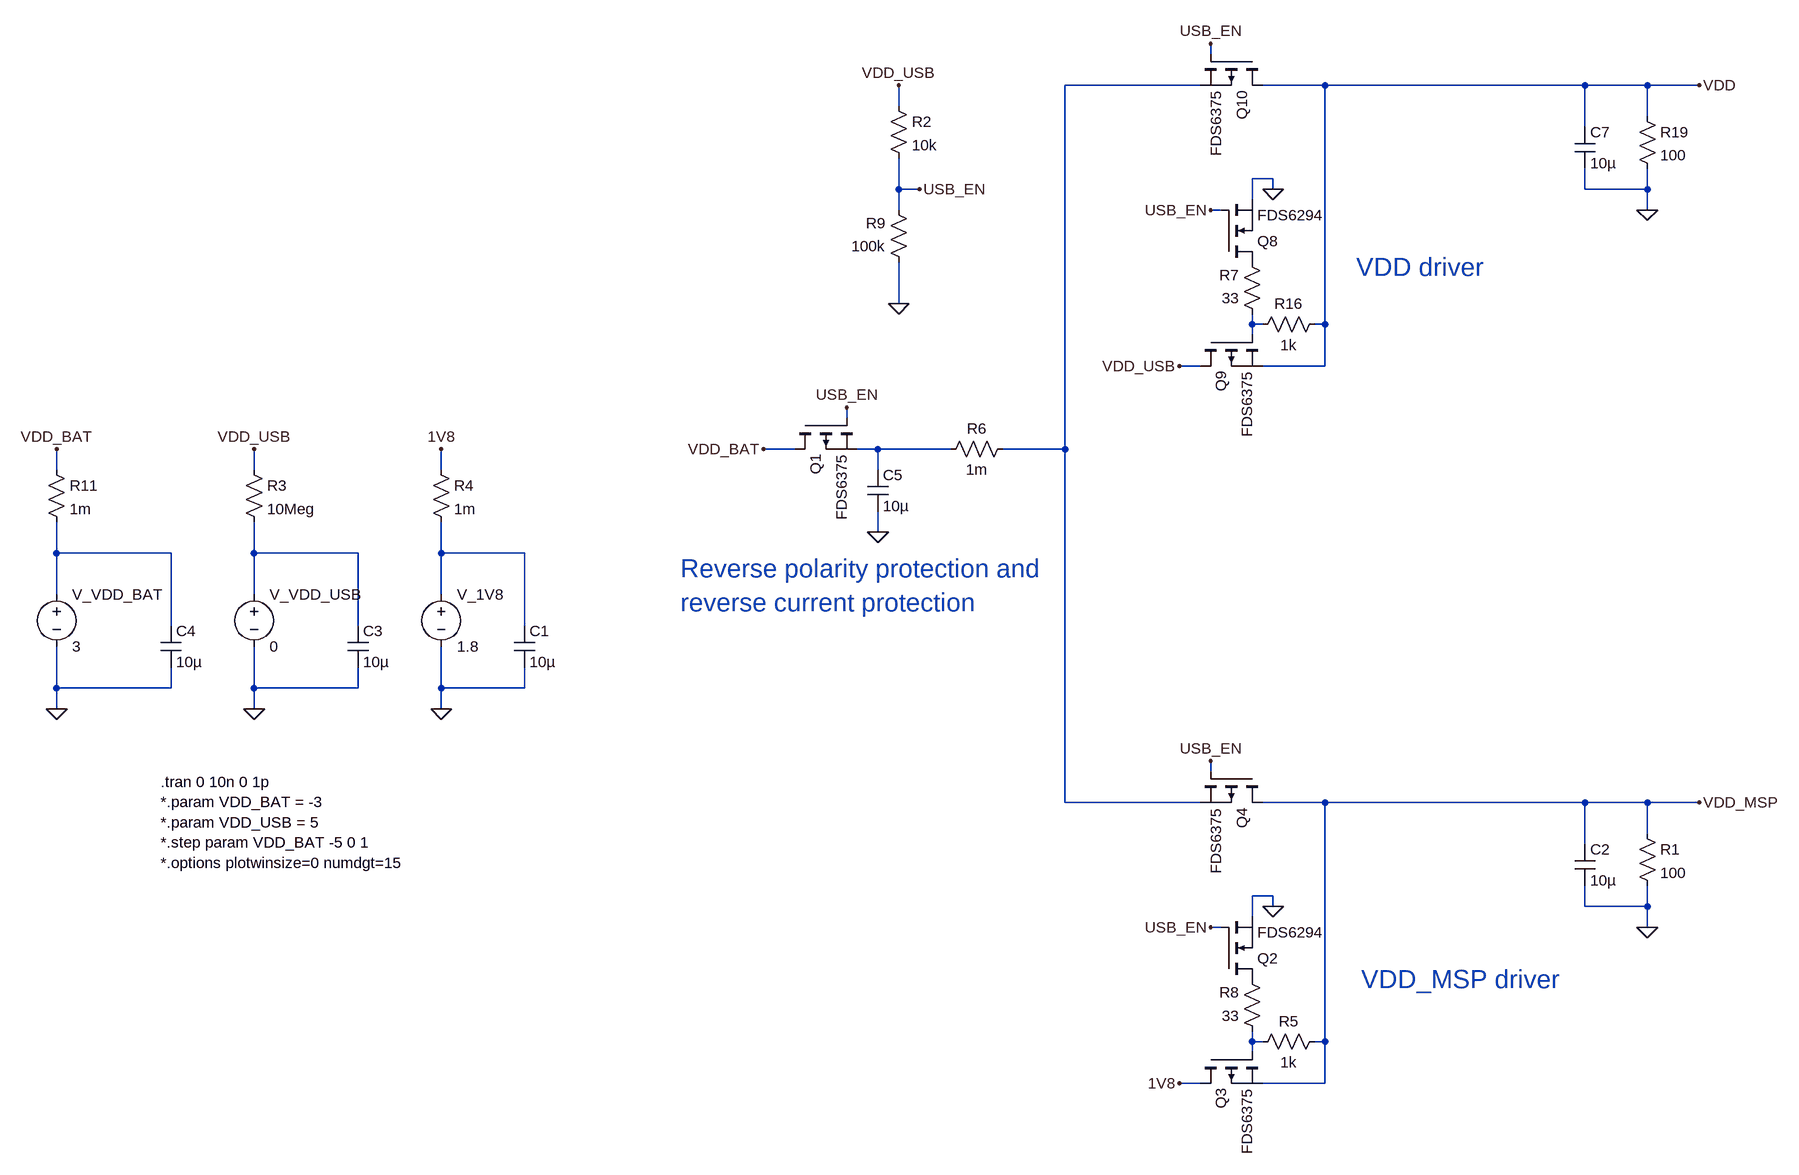
[diagram p0: schematic Schematic.asc]
Schematic.asc, the LTspice schematic file:
Version 4
SHEET 1 1688 680
WIRE -384 -1200 -384 -1216
WIRE -400 -1152 -608 -1152
WIRE -208 -1152 -304 -1152
WIRE 192 -1152 -208 -1152
WIRE 288 -1152 192 -1152
WIRE 368 -1152 288 -1152
WIRE -864 -1120 -864 -1152
WIRE 288 -1104 288 -1152
WIRE 192 -1088 192 -1152
WIRE -288 -1008 -320 -1008
WIRE -864 -992 -864 -1040
WIRE -832 -992 -864 -992
WIRE -288 -992 -288 -1008
WIRE 192 -992 192 -1024
WIRE 288 -992 288 -1024
WIRE 288 -992 192 -992
WIRE -320 -976 -320 -1008
WIRE -864 -960 -864 -992
WIRE -368 -960 -384 -960
WIRE 288 -960 288 -992
WIRE -864 -816 -864 -880
WIRE -320 -784 -320 -800
WIRE -304 -784 -320 -784
WIRE -208 -784 -208 -1152
WIRE -208 -784 -224 -784
WIRE -320 -768 -320 -784
WIRE -400 -720 -432 -720
WIRE -208 -720 -208 -784
WIRE -208 -720 -304 -720
WIRE -944 -640 -944 -656
WIRE -1024 -592 -1072 -592
WIRE -896 -592 -928 -592
WIRE -784 -592 -896 -592
WIRE -608 -592 -608 -1152
WIRE -608 -592 -704 -592
WIRE -2160 -560 -2160 -592
WIRE -1856 -560 -1856 -592
WIRE -1568 -560 -1568 -592
WIRE -896 -560 -896 -592
WIRE -896 -464 -896 -496
WIRE -2160 -432 -2160 -480
WIRE -1984 -432 -2160 -432
WIRE -1856 -432 -1856 -480
WIRE -1696 -432 -1856 -432
WIRE -1568 -432 -1568 -480
WIRE -1440 -432 -1568 -432
WIRE -2160 -368 -2160 -432
WIRE -1856 -368 -1856 -432
WIRE -1568 -368 -1568 -432
WIRE -1984 -320 -1984 -432
WIRE -1696 -320 -1696 -432
WIRE -1440 -320 -1440 -432
WIRE -2160 -224 -2160 -288
WIRE -1984 -224 -1984 -256
WIRE -1984 -224 -2160 -224
WIRE -1856 -224 -1856 -288
WIRE -1696 -224 -1696 -256
WIRE -1696 -224 -1856 -224
WIRE -1568 -224 -1568 -288
WIRE -1440 -224 -1440 -256
WIRE -1440 -224 -1568 -224
WIRE -2160 -192 -2160 -224
WIRE -1856 -192 -1856 -224
WIRE -1568 -192 -1568 -224
WIRE -384 -96 -384 -112
WIRE -608 -48 -608 -592
WIRE -400 -48 -608 -48
WIRE -208 -48 -304 -48
WIRE 192 -48 -208 -48
WIRE 288 -48 192 -48
WIRE 368 -48 288 -48
WIRE 288 0 288 -48
WIRE 192 16 192 -48
WIRE -288 96 -320 96
WIRE -288 112 -288 96
WIRE 192 112 192 80
WIRE 288 112 288 80
WIRE 288 112 192 112
WIRE -320 128 -320 96
WIRE -368 144 -384 144
WIRE 288 144 288 112
WIRE -320 320 -320 304
WIRE -304 320 -320 320
WIRE -208 320 -208 -48
WIRE -208 320 -224 320
WIRE -320 336 -320 320
WIRE -400 384 -432 384
WIRE -208 384 -208 320
WIRE -208 384 -304 384
FLAG 368 -48 VDD_MSP
FLAG -1856 -192 0
FLAG -2160 -192 0
FLAG -1568 -192 0
FLAG 288 144 0
FLAG -864 -1152 VDD_USB
FLAG -1856 -592 VDD_USB
FLAG -1568 -592 1V8
FLAG -1072 -592 VDD_BAT
FLAG -2160 -592 VDD_BAT
FLAG -896 -464 0
FLAG -864 -816 0
FLAG -432 -720 VDD_USB
FLAG 368 -1152 VDD
FLAG 288 -960 0
FLAG -288 -992 0
FLAG -832 -992 USB_EN
FLAG -384 -1216 USB_EN
FLAG -944 -656 USB_EN
FLAG -384 -960 USB_EN
FLAG -432 384 1V8
FLAG -288 112 0
FLAG -384 -112 USB_EN
FLAG -384 144 USB_EN
SYMBOL res 272 -16 R0
SYMATTR InstName R1
SYMATTR Value 100
SYMBOL res -880 -1136 R0
SYMATTR InstName R2
SYMATTR Value 10k
SYMBOL res -1872 -576 R0
SYMATTR InstName R3
SYMATTR Value 10Meg
SYMBOL cap 176 16 R0
SYMATTR InstName C2
SYMATTR Value 10µ
SYMBOL cap -1456 -320 R0
SYMATTR InstName C1
SYMATTR Value 10µ
SYMBOL cap -1712 -320 R0
SYMATTR InstName C3
SYMATTR Value 10µ
SYMBOL cap -2000 -320 R0
SYMATTR InstName C4
SYMATTR Value 10µ
SYMBOL res -2176 -576 R0
SYMATTR InstName R11
SYMATTR Value 1m
SYMBOL voltage -2160 -384 R0
SYMATTR InstName V_VDD_BAT
SYMATTR Value 3
SYMATTR SpiceLine Cpar=1f
SYMBOL voltage -1856 -384 R0
SYMATTR InstName V_VDD_USB
SYMATTR Value 0
SYMBOL voltage -1568 -384 R0
SYMATTR InstName V_1V8
SYMATTR Value 1.8
SYMBOL res -1584 -576 R0
SYMATTR InstName R4
SYMATTR Value 1m
SYMBOL pmos -1024 -640 M90
SYMATTR InstName Q1
SYMATTR Value FDS6375
SYMBOL cap -912 -560 R0
SYMATTR InstName C5
SYMATTR Value 10µ
SYMBOL res -848 -864 R180
WINDOW 0 36 76 Left 2
WINDOW 3 36 40 Left 2
SYMATTR InstName R9
SYMATTR Value 100k
SYMBOL res -208 -800 R90
WINDOW 0 0 56 VBottom 2
WINDOW 3 32 56 VTop 2
SYMATTR InstName R16
SYMATTR Value 1k
SYMBOL res 272 -1120 R0
SYMATTR InstName R19
SYMATTR Value 100
SYMBOL cap 176 -1088 R0
SYMATTR InstName C7
SYMATTR Value 10µ
SYMBOL nmos -368 -880 M180
SYMATTR InstName Q8
SYMATTR Value FDS6294
SYMBOL pmos -400 -768 M90
SYMATTR InstName Q9
SYMATTR Value FDS6375
SYMBOL pmos -304 -1200 R90
SYMATTR InstName Q10
SYMATTR Value FDS6375
SYMBOL res -688 -608 R90
WINDOW 0 0 56 VBottom 2
WINDOW 3 32 56 VTop 2
SYMATTR InstName R6
SYMATTR Value 1m
SYMBOL res -304 -784 R180
WINDOW 0 36 76 Left 2
WINDOW 3 36 40 Left 2
SYMATTR InstName R7
SYMATTR Value 33
SYMBOL res -208 304 R90
WINDOW 0 0 56 VBottom 2
WINDOW 3 32 56 VTop 2
SYMATTR InstName R5
SYMATTR Value 1k
SYMBOL nmos -368 224 M180
SYMATTR InstName Q2
SYMATTR Value FDS6294
SYMBOL pmos -400 336 M90
SYMATTR InstName Q3
SYMATTR Value FDS6375
SYMBOL pmos -304 -96 R90
SYMATTR InstName Q4
SYMATTR Value FDS6375
SYMBOL res -304 320 R180
WINDOW 0 36 76 Left 2
WINDOW 3 36 40 Left 2
SYMATTR InstName R8
SYMATTR Value 33
TEXT -2000 -80 Left 2 !.tran 0 10n 0 1p\n*.param VDD_BAT = -3\n*.param VDD_USB = 5\n*.step param VDD_BAT -5 0 1\n*.options plotwinsize=0 numdgt=15
TEXT -1200 -408 Left 4 ;Reverse polarity protection and\nreverse current protection
TEXT -160 -872 Left 4 ;VDD driver
TEXT -152 224 Left 4 ;VDD_MSP driver

The netlist it stands for:
* Schematic.asc
R1 VDD_MSP 0 100
R2 VDD_USB USB_EN 10k
R3 VDD_USB N005 10Meg
C2 VDD_MSP 0 10µ
C1 N006 0 10µ
C3 N005 0 10µ
C4 N004 0 10µ
R11 VDD_BAT N004 1m
V_VDD_BAT N004 0 3 Cpar=1f
V_VDD_USB N005 0 0
V_1V8 N006 0 1.8
R4 1V8 N006 1m
M§Q1 VDD_BAT USB_EN N003 N003 FDS6375
C5 N003 0 10µ
R9 0 USB_EN 100k
R16 VDD N002 1k
R19 VDD 0 100
C7 VDD 0 10µ
M§Q8 P001 USB_EN 0 0 FDS6294
M§Q9 VDD_USB N002 VDD VDD FDS6375
M§Q10 VDD USB_EN N001 N001 FDS6375
R6 N001 N003 1m
R7 N002 P001 33
R5 VDD_MSP N007 1k
M§Q2 P002 USB_EN 0 0 FDS6294
M§Q3 1V8 N007 VDD_MSP VDD_MSP FDS6375
M§Q4 VDD_MSP USB_EN N001 N001 FDS6375
R8 N007 P002 33
.model NMOS NMOS
.model PMOS PMOS
.lib standard.mos
.tran 0 10n 0 1p
*.param VDD_BAT = -3
*.param VDD_USB = 5
*.step param VDD_BAT -5 0 1
*.options plotwinsize=0 numdgt=15
* Reverse polarity protection and
* reverse current protection
* VDD driver
* VDD_MSP driver
.backanno
.end